# EAGLE design ACS_PCB (EAGLE 7.2.0)
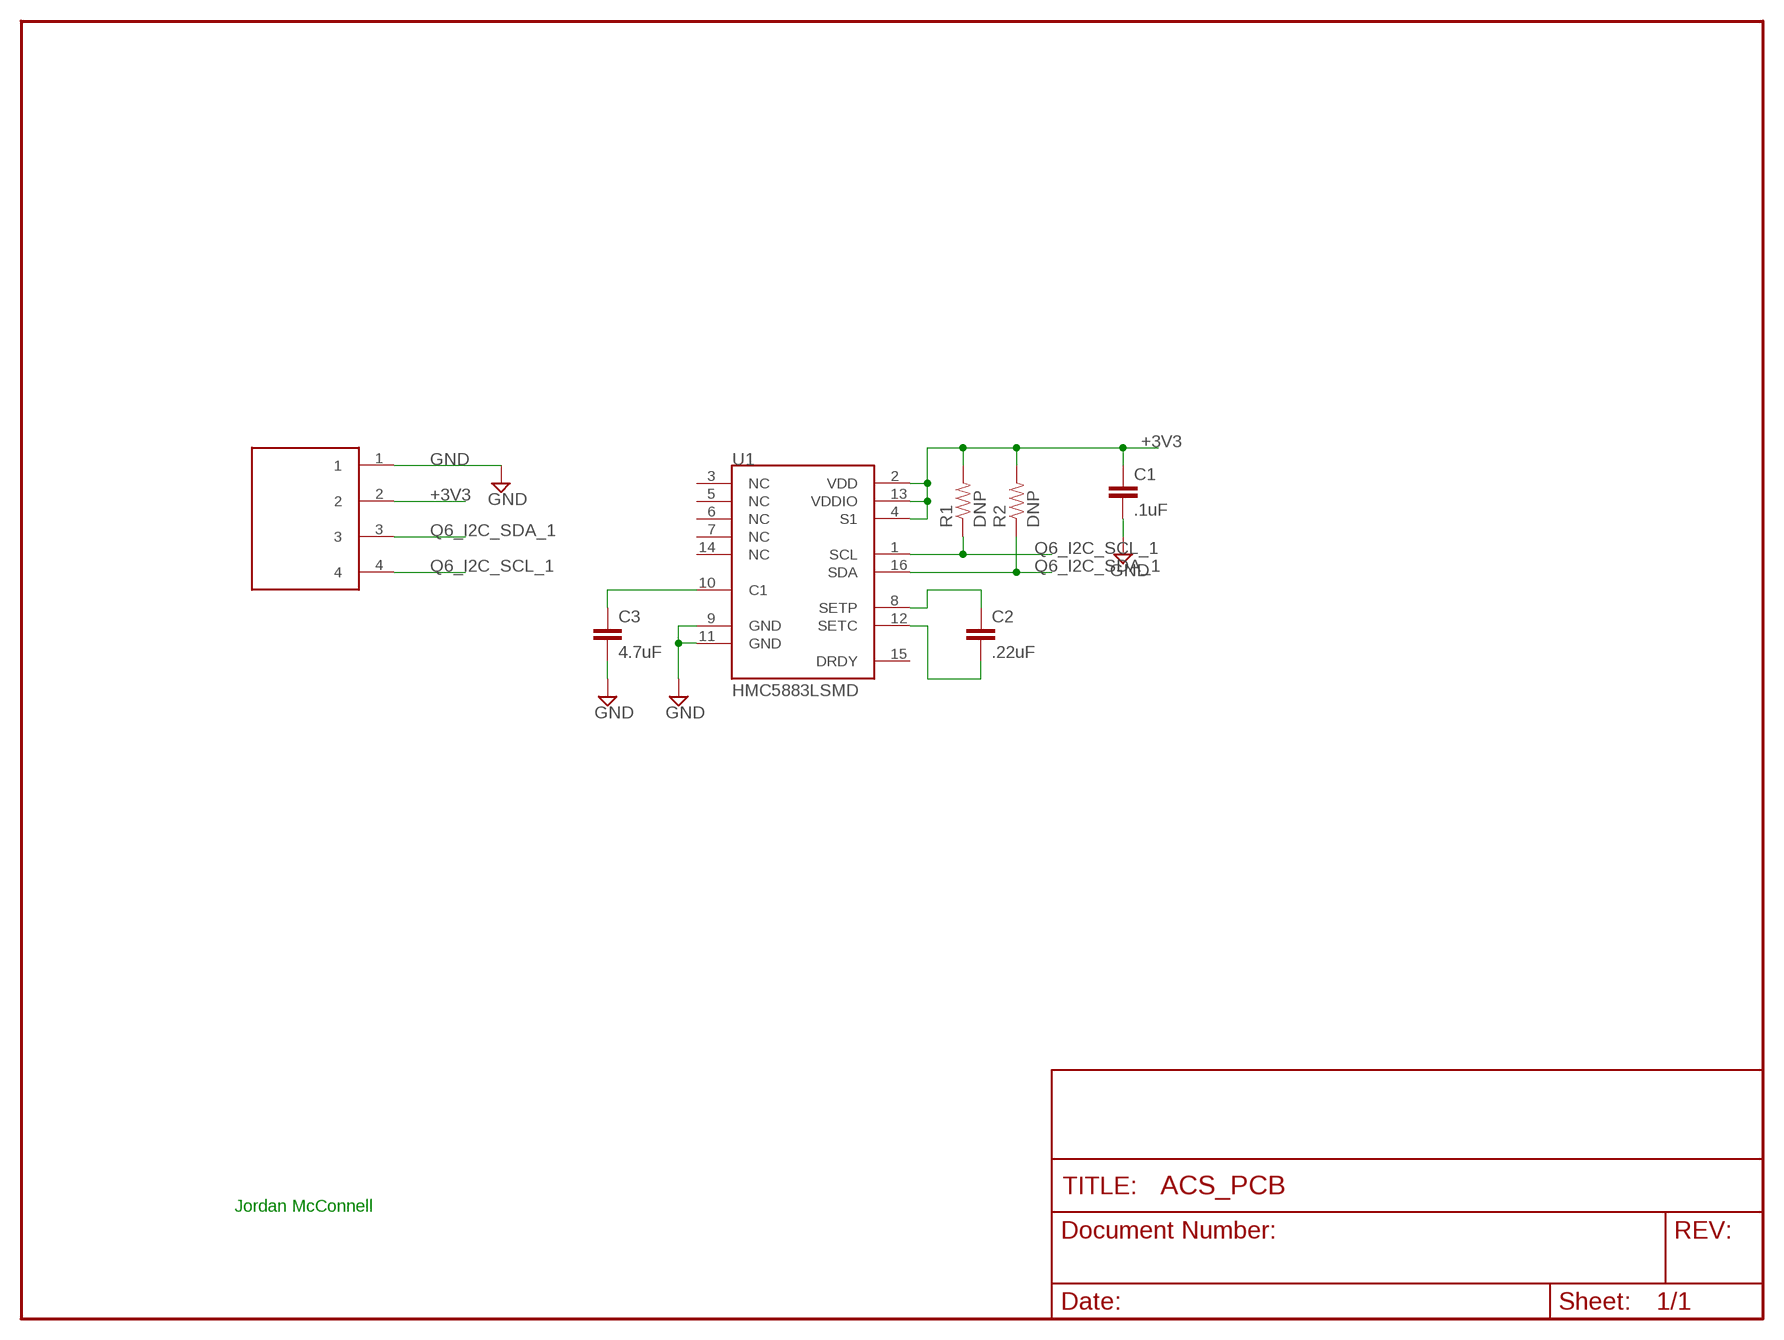
[diagram p0: schematic, sheet 1]

## Parts
C1  .1uF  CAP0402-CAP  [0402-CAP]
C2  .22uF  CAP0402-CAP  [0402-CAP]
C3  4.7uF  CAP0402-CAP  [0402-CAP]
J1  M80-879  [M80-879]
R1  DNP  RESISTOR0402-RES  [0402-RES]
R2  DNP  RESISTOR0402-RES  [0402-RES]
U1  HMC5883LSMD  [16LPCC]

## Nets
+3V3: C1.1 J1.2 R1.2 R2.2 U1.2(VDD) U1.4(S1) U1.13(VDDIO)
GND: C1.2 C3.2 J1.1 U1.9(GND) U1.11(GND)
N$1: C3.1 U1.10(C1)
N$4: C2.1 U1.8(SETP)
N$5: C2.2 U1.12(SETC)
Q6_I2C_SCL_1: J1.4 R1.1 U1.1(SCL)
Q6_I2C_SDA_1: J1.3 R2.1 U1.16(SDA)
Unconnected: U1.3(NC) U1.5(NC) U1.6(NC) U1.7(NC) U1.14(NC) U1.15(DRDY)

## Notes on the sheet
- Jordan McConnell

## Library data of the parts
C1-C3 = SparkFun:CAP: Capacitor Standard 0603 ceramic capacitor, and 0.1" leaded capacitor.
J1 = harwin:M80-879
R1 R2 = SparkFun:RESISTOR: Resistor Basic schematic elements and footprints for 0603, 1206, and PTH resistors.
U1 = SparkFun:HMC5883L: 3 Axis Digital Compass IC

## Board
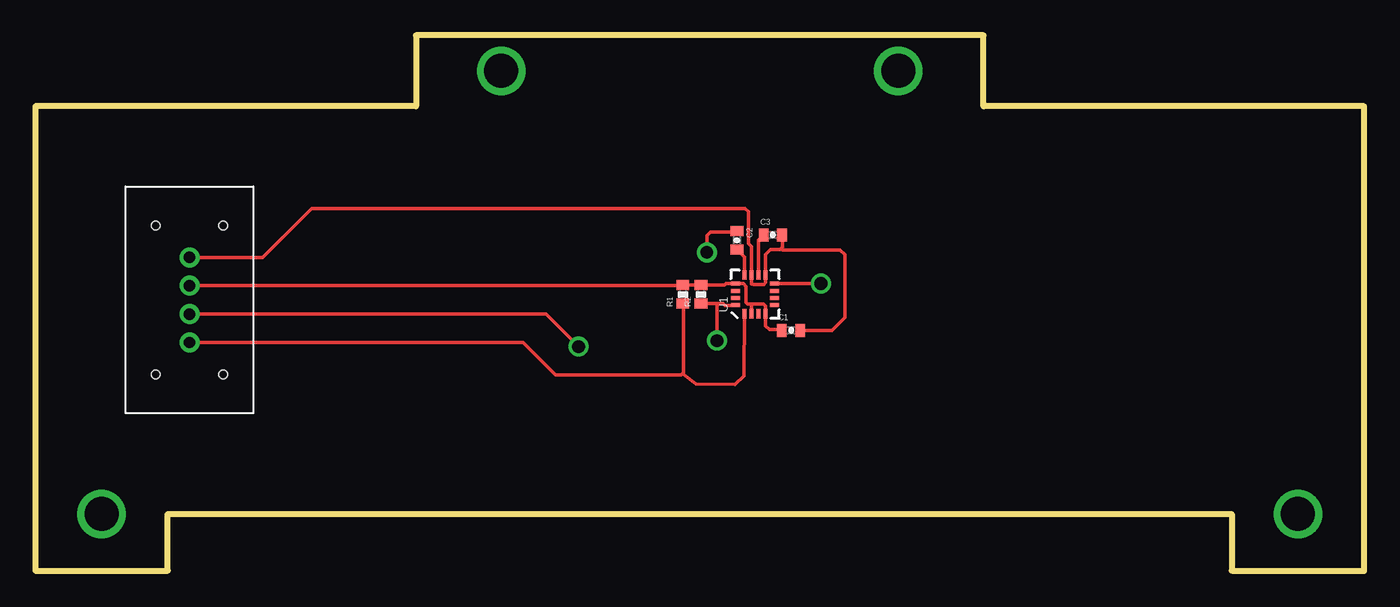
[diagram p1: board, top side]
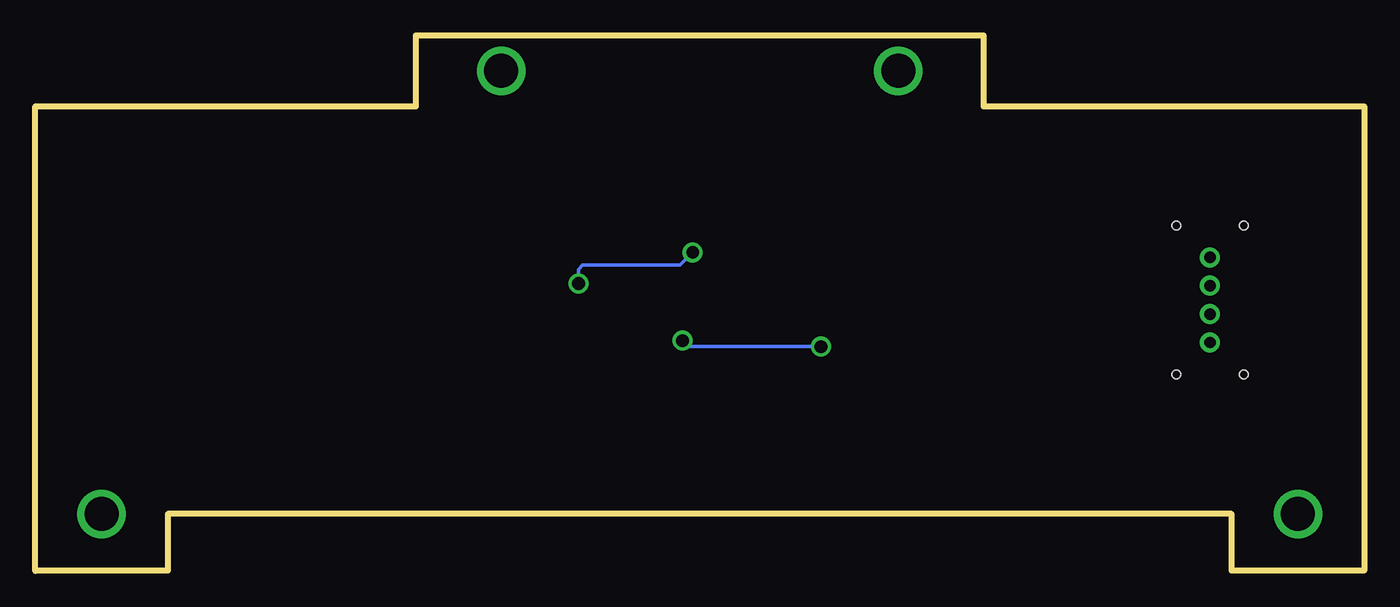
[diagram p2: board, bottom side, seen from below]

Size 93.65 x 37.77 mm. Coordinates in mm from the lower left corner, seen from the top.
Outline: 93.65,0.03 84.33,0.03 84.33,4.03 9.32,4.03 9.32,0.03 0,0.03 0,32.77 26.82,32.77 26.82,37.77 66.83,37.77 66.83,32.77 93.65,32.77 93.65,0.03
Outline: 93.65,0 93.65,0.03
Copper layers (1*16): Top 0.035mm / dielectric 1.5mm / Bottom 0.035mm
Design rules "default": minimum track width 8mil, minimum drill 20mil, track to track 8mil, track to pad 8mil, pad to pad 8mil, via to via 8mil, smd to smd 8mil, copper to edge 10mil, drill to drill 8mil, minimum pad ring 12mil, minimum via ring 10mil, stop-mask expansion 4mil, vias tented up to drill 25mil, thermal gap 10mil

### Footprints (pad centres in the part's own frame; a part is rotated, then mirrored left to right if it is on the bottom)
0402-CAP = smd 0.7 x 0.9: 1 -0.65,0; 2 0.65,0
M80-879 = drill 0.8: 1 -3,0; 2 -1,0; 3 1,0; 4 3,0 | hole 0.6: 5.25,2.375; 5.25,-2.375; -5.25,-2.375; -5.25,2.375
0402-RES = smd 0.7 x 0.9: 1 -0.65,0; 2 0.65,0
16LPCC = smd 0.65 x 0.28: 1 -1.37,0.75; 2 -1.37,0.25; 3 -1.37,-0.25; 4 -1.37,-0.75; 9 1.37,-0.75; 10 1.37,-0.25; 11 1.37,0.25; 12 1.37,0.75 | smd 0.28 x 0.65: 5 -0.75,-1.37; 6 -0.25,-1.37; 7 0.25,-1.37; 8 0.75,-1.37; 13 0.75,1.37; 14 0.25,1.37; 15 -0.25,1.37; 16 -0.75,1.37

### Placement (x,y rotation side)
C1  53.26,16.97 0 top
C2  49.45,23.32 270 top
C3  51.98,23.71 0 top
J1  10.86,19.12 270 top
R1  45.63,19.51 90 top
R2  46.91,19.51 90 top
U1  50.72,19.51 90 top

### Tracks (layer width: path | path; a pad name or v marks a point on that pad's centre or on a via)
+3V3
  Top 0.254: R1.2 R2.2 48.56,20.16 48.67,20.27 49.34,20.27 U1.13 49.9,20.27 50.08,20.07 50.08,18.95 50.2,18.82 50.52,18.82 | R1.2 45.62,20.15 | U1.2 50.47,18.76 50.52,18.82 | 50.52,18.82 51.3,18.82 51.48,18.7 51.48,18.18 U1.4 51.47,17.29 51.73,17.02 52.55,17.02 C1.1 | J1.2 45.59,20.12 R1.2
GND
  Top 0.254: 52.55,22.75 52.48,22.67 51.8,22.67 51.47,22.34 U1.9 51.47,20.34 51.35,20.2 50.6,20.2 50.48,20.25 50.48,20.38 U1.11 50.47,22.88 50.25,23.1 50.25,25.35 50.02,25.57 44.42,25.57 44.4,25.55 19.45,25.55 16.02,22.12 J1.1 | 52.55,22.75 52.65,22.85 52.65,23.69 C3.2 | C1.2 56.15,16.97 57.05,17.88 57.05,22.32 56.73,22.65 52.65,22.65 52.55,22.75
N$1
  Top 0.254: U1.10 50.97,23.34 C3.1
N$2  (via drill 2.4)
  other vias: 4.66,4.03
N$3  (via drill 2.4)
  other vias: 32.83,35.27
N$4  (via drill 0.9)
  Top 0.254: 52.1,20.28 U1.8 52.91,20.26 v55.38,20.27 | v47.33,22.47 47.33,23.65 47.6,23.92 49.4,23.92 C2.1
  Bottom 0.254: v47.33,22.47 48.23,21.57 55.08,21.57 55.38,21.27 v55.38,20.27
N$5
  Top 0.254: U1.12 49.97,22.15 C2.2
N$6  (via drill 2.4)
  other vias: 60.83,35.27
N$7  (via drill 2.4)
  other vias: 88.99,4.03
Q6_I2C_SCL_1
  Top 0.254: U1.1 49.94,13.77 49.33,13.18 46.58,13.2 45.67,13.88 45.67,14.03 | 45.67,14.03 45.67,18.82 R1.1 | J1.4 34.38,16.12 36.65,13.85 45.5,13.85 45.67,14.03
Q6_I2C_SDA_1  (via drill 0.9)
  Top 0.254: R2.1 48.23,18.86 | 48.23,18.86 48.46,18.86 48.6,18.72 49.3,18.72 U1.16 | J1.3 35.98,18.12 v38.27,15.83 | v48.05,16.25 48.05,18.69 48.23,18.86
  Bottom 0.254: v38.27,15.83 47.62,15.83 v48.05,16.25